# EAGLE design SOP-8_2 PCB (EAGLE 9.6.2)
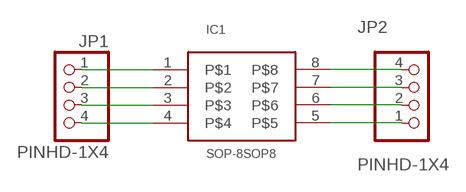
[diagram p0: schematic, sheet 1]

## Parts
IC1  SOP-8SOP8  [SOP-8]
JP1  PINHD-1X4  [1X04]
JP2  PINHD-1X4  [1X04]

## Nets
N$1: IC1.8 JP2.4
N$2: IC1.7 JP2.3
N$3: IC1.6 JP2.2
N$4: IC1.5 JP2.1
N$5: IC1.1 JP1.1
N$6: IC1.2 JP1.2
N$7: IC1.3 JP1.3
N$8: IC1.4 JP1.4

## Library data of the parts
IC1 = SOP-8:SOP-8: SOP-8; AVAILABILITY: In Stock; DESCRIPTION: EEPROM Memory IC 2Kb (256 x 8) I²C 1MHz 550ns 8-Mini Map (2x3); MF: Microchip; MP: AT24C02; PACKAGE: UDFN-8 Microchip; PRICE: None; PURCHASE-URL: https://pricing.snapeda.com/search/part/AT24C02/?ref=eda
JP1 JP2 = Connector:PINHD-1X4: PIN HEADER; CATEGORY: CONNECTOR; SUB-CATEGORY: PIN-HEADER

## Board
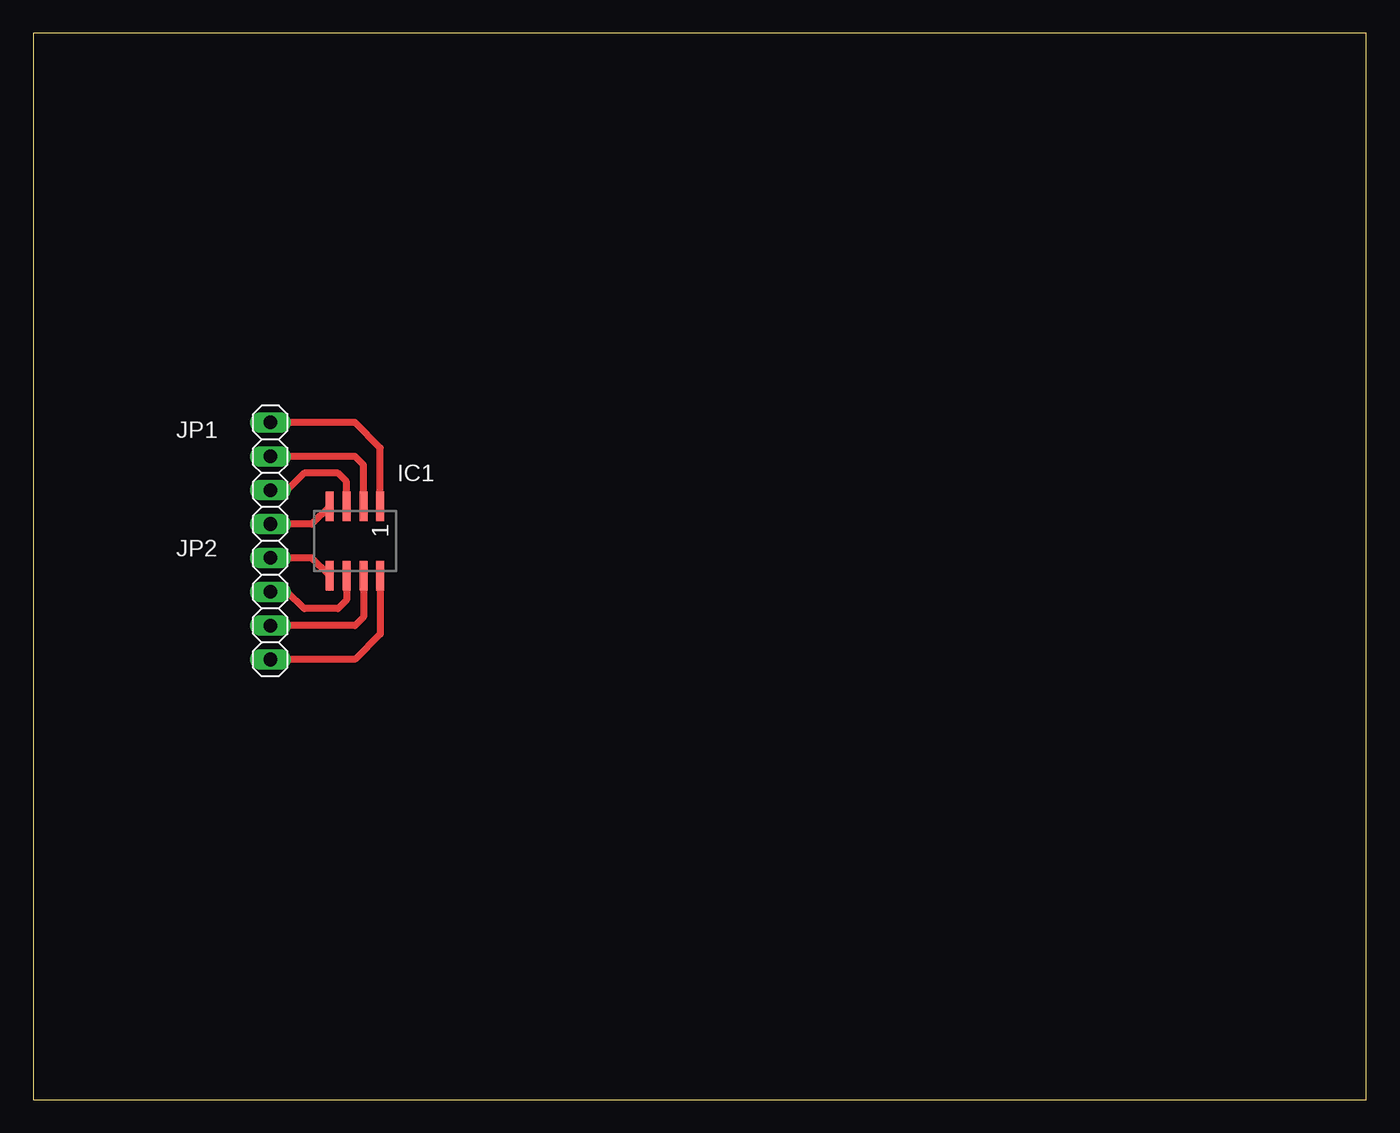
[diagram p1: board, top side]

Size 100 x 80 mm. Coordinates in mm from the lower left corner, seen from the top.
Outline: 0,0 100,0 100,80 0,80 0,0
Copper layers (1*16): Top 0.035mm / dielectric 1.5mm / Bottom 0.035mm
Design rules "default": minimum track width 6mil, minimum drill 0.35mm, track to track 6mil, track to pad 6mil, pad to pad 6mil, via to via 6mil, smd to smd 6mil, copper to edge 40mil, drill to drill 6mil, minimum pad ring 10mil, minimum via ring 8mil, stop-mask expansion 4mil, vias tented up to drill 0mil, thermal gap 10mil

### Footprints (pad centres in the part's own frame; a part is rotated, then mirrored left to right if it is on the bottom)
SOP-8 = smd 0.6 x 2.2: 1 -1.905,-2.6; 2 -0.635,-2.6; 3 0.635,-2.6; 4 1.905,-2.6; 5 1.905,2.6; 6 0.635,2.6; 7 -0.635,2.6; 8 -1.905,2.6
1X04 = drill 1.016 long: 1 -3.81,0; 2 -1.27,0; 3 1.27,0; 4 3.81,0

### Placement (x,y rotation side)
IC1  24.13,41.91 180 top
JP1  17.78,46.99 270 top
JP2  17.78,36.83 270 top

### Tracks (layer width: path | path; a pad name or v marks a point on that pad's centre or on a via)
N$1
  Top 0.508: IC1.8 26.04,34.92 24.13,33.02 JP2.4
N$2
  Top 0.508: IC1.7 24.77,36.2 24.13,35.56 JP2.3
N$3
  Top 0.152: 19.05,38.1 JP2.2
  Top 0.508: IC1.6 23.5,37.47 22.86,36.83 20.32,36.83 19.05,38.1
N$4
  Top 0.508: IC1.5 20.89,40.64 JP2.1
N$5
  Top 0.508: IC1.1 26.04,48.9 24.13,50.8 JP1.1
N$6
  Top 0.508: IC1.2 24.77,47.62 24.13,48.26 JP1.2
N$7
  Top 0.508: IC1.3 23.5,46.35 22.86,46.99 20.32,46.99 19.05,45.72 JP1.3
N$8
  Top 0.508: IC1.4 20.89,43.18 JP1.4